# EasyEDA Pro project lora_repeter_2.eprj

# Schematic lora_repeter_2
Board Name: lora_repeter_2; Create Date: 2025-03-23; Page Name: lora_repeter_2; Project Name: lora_repeter_2; Schematic Name: lora_repeter_2; Update Date: 2025-03-23; File: lora_repeter_2; Id: /; Sheet: /
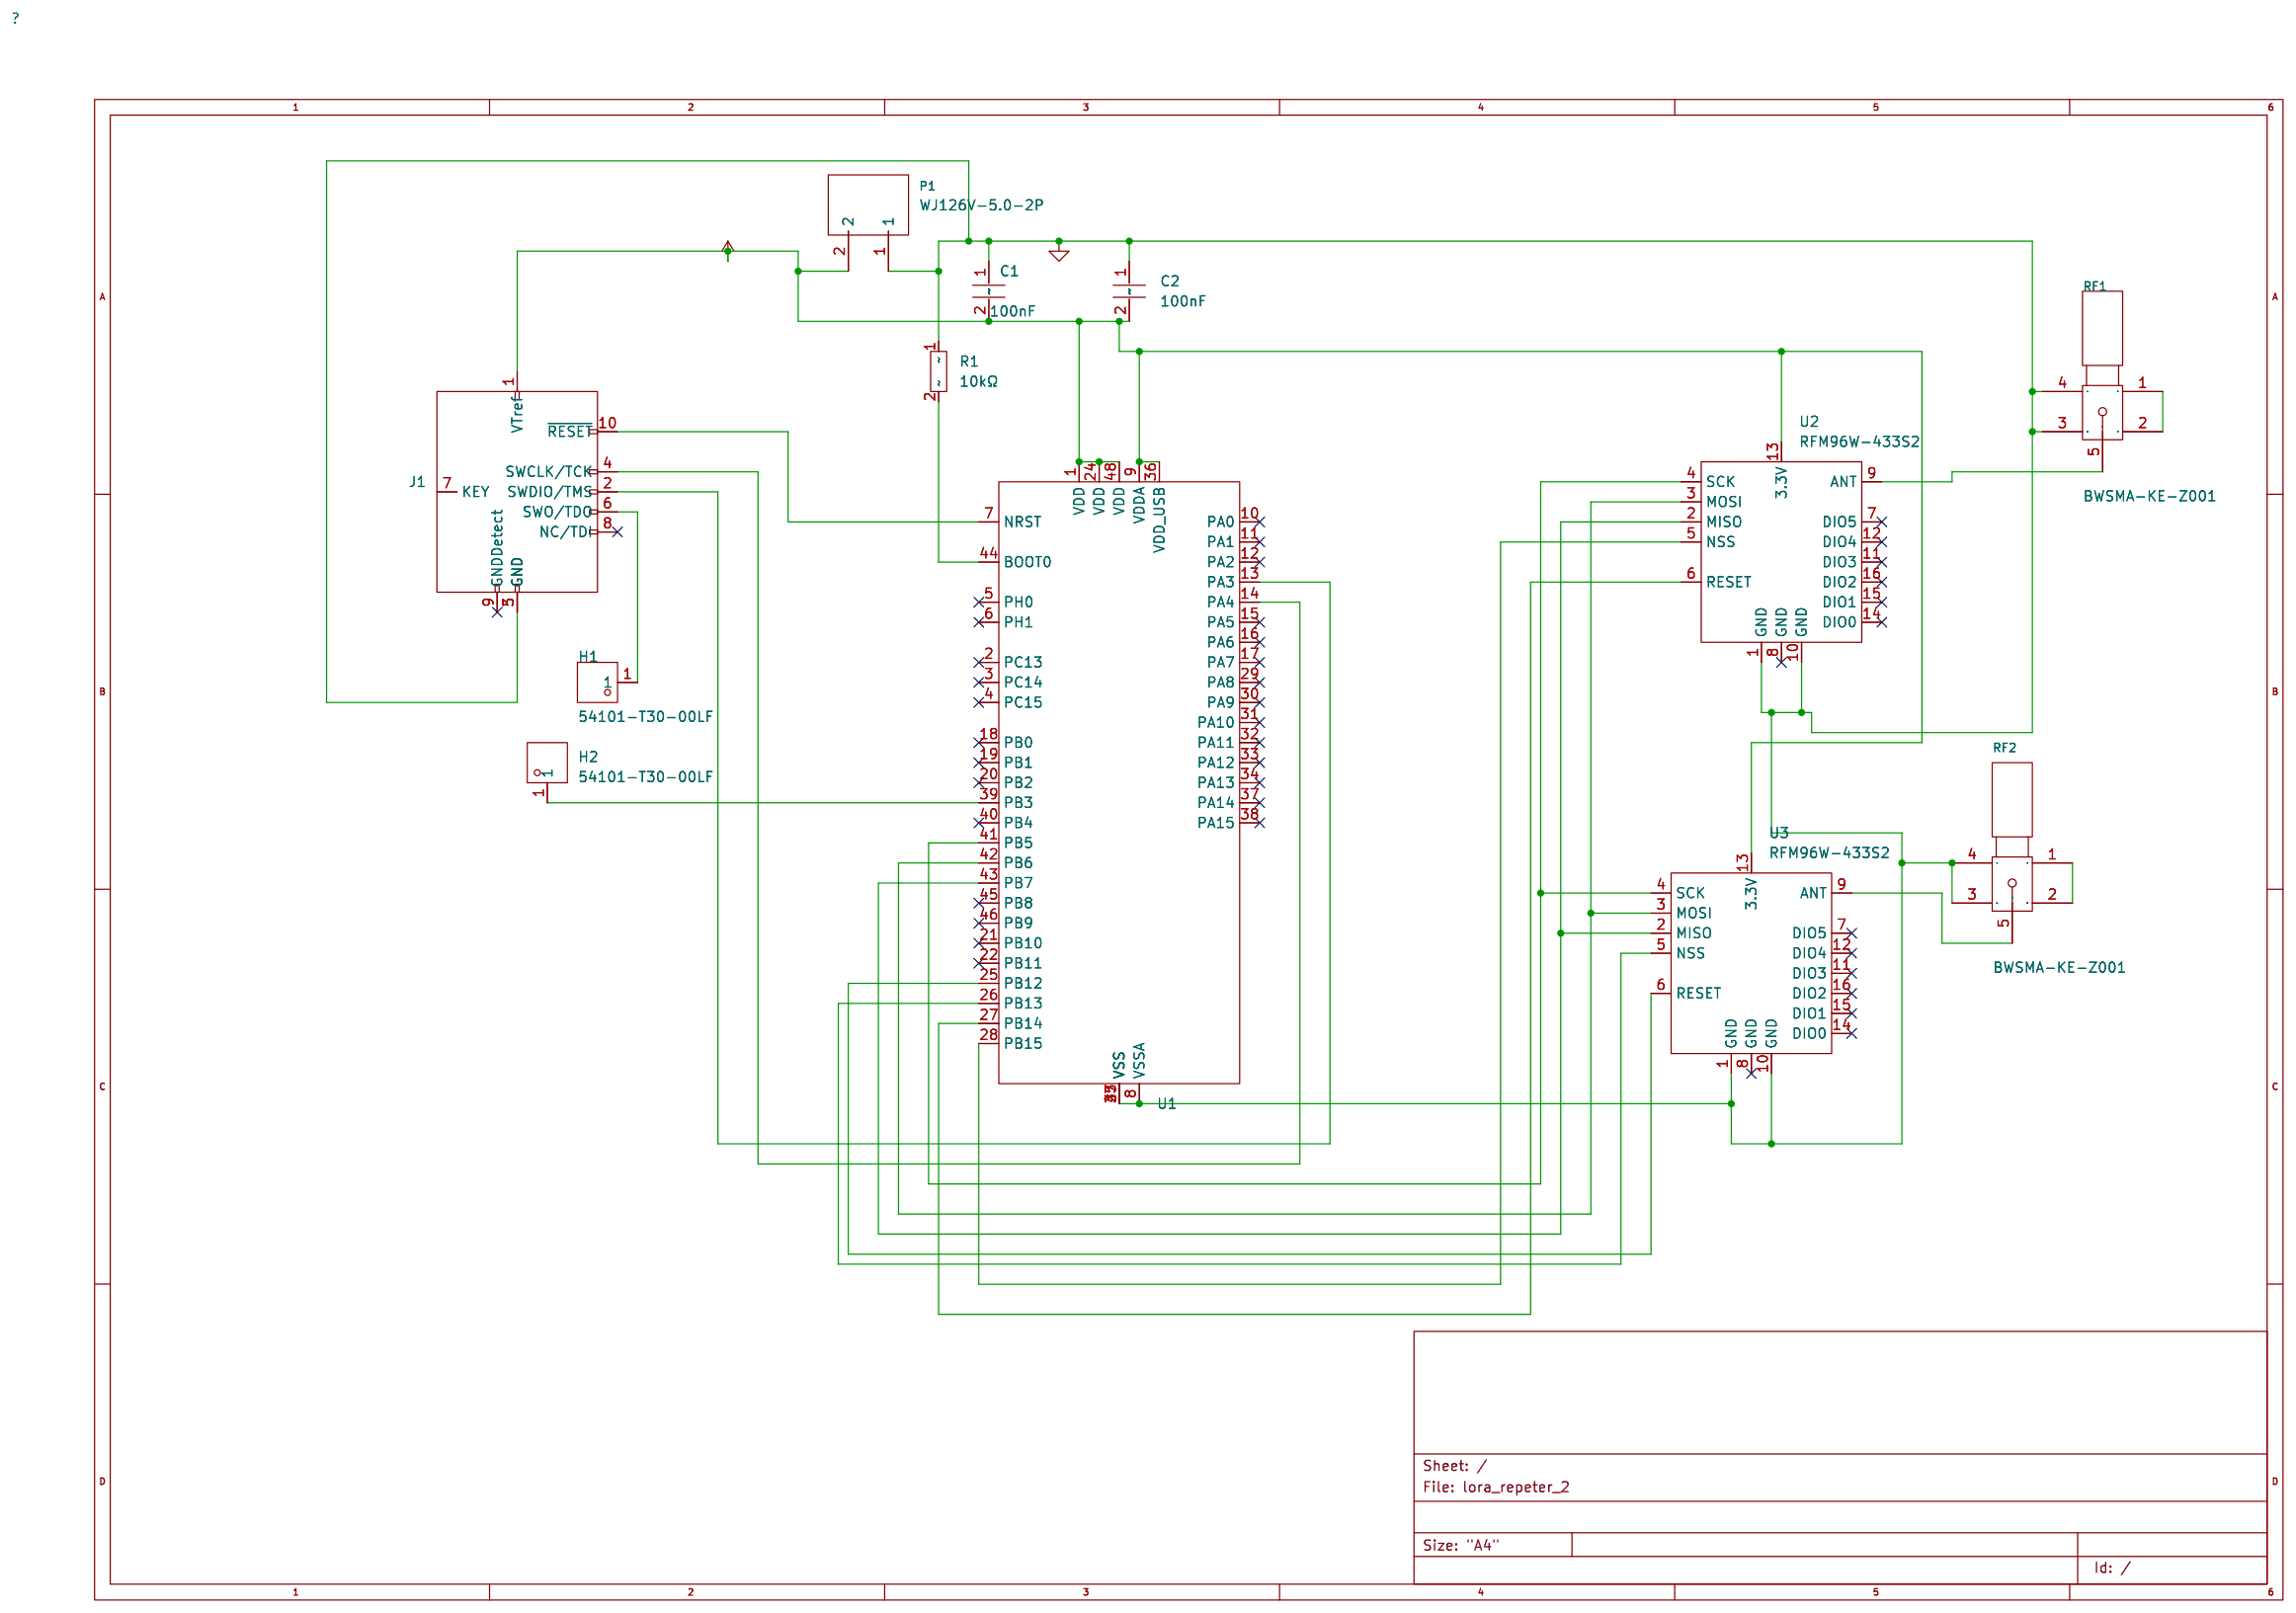
[diagram p0: schematic sheet]

## Parts
C1  100nF  [CAP-TH_L5.0-W2.5-P5.08-D0.7]
C2  100nF  [CAP-TH_L5.0-W2.5-P5.08-D0.7]
H1  54101-T30-00LF  [HDR-TH_1P-P2.54-V-M]
H2  54101-T30-00LF  [HDR-TH_1P-P2.54-V-M]
J1  2.54-2*5P简牛  [IDC-TH_10P-P2.54_C5665]
P1  WJ126V-5.0-2P  [CONN-TH_WJ126V-5.0-2P]
R1  10kΩ  [RES-TH_BD2.3-L6.5-P10.50-D0.5]
RF1  BWSMA-KE-Z001  [SMA-TH_BWSMA-KE-Z001]
RF2  BWSMA-KE-Z001  [SMA-TH_BWSMA-KE-Z001]
U1  STM32L072CBT6  [LQFP-48_L7.0-W7.0-P0.50-LS9.0-BL]
U2  RFM96W-433S2
U3  RFM96W-433S2

## Library data of the parts
C1 C2 = CC1H104ZC74D3F5O30MN: Capacitance: Tolerance:-20%~+80% Tolerance:-20%~+80% Voltage Rated: Lead Spacing: Temperature Coefficient: φD: Body Thickness:; LCSC Part Name: 100nF -20%~+80% 50V; Supplier Part: C254094; Manufacturer: Dersonic(德尔创); Supplier Footprint: 插件,P=5.08mm; JLCPCB Part Class: Extended Part; Datasheet: https://atta.szlcsc.com/upload/public/pdf/source/20200826/C254094_5CB2628DB82B55380EF0EA1FCCF0C073.pdf; Supplier: LCSC; Tolerance: -20%~+80%
H1 H2 = 54101-T30-00LF: LCSC Part Name: 54101-T30-00LF 单排针，价格为单根针，包装为圆盘; Supplier Part: C5156075; Manufacturer: Amphenol; Supplier Footprint: 插件,P=2.54mm; JLCPCB Part Class: Extended Part; Datasheet: https://atta.szlcsc.com/upload/public/pdf/source/20221214/EBCE81CA20C160EAA37EFECDD5FC8CA8.pdf; Supplier: LCSC
J1 = 2.54-2*5P简牛: Connector Type:简牛座 Pitch:2.54mm Structure:2x5P Holder Type:Straight Row Spacing:2.54mm Number of Rows:2 Pin Number in each Row:5 Contact Material:- Contact Plating:-; LCSC Part Name: 2.54mm 2x5P 排数:2 每排P数:5; Supplier Part: C5665; Manufacturer: BOOMELE(博穆精密); Supplier Footprint: 插件,P=2.54mm; JLCPCB Part Class: Extended Part; Datasheet: https://atta.szlcsc.com/upload/public/pdf/source/20140331/1457707037896.pdf; Supplier: LCSC; Connector Type: 简牛座; Pitch: 2.54mm; Structure: 2x5P; Holder Type: Straight; Row Spacing: 2.54mm; Number of Rows: 2; Pin Number in each Row: 5
P1 = WJ126V-5.0-2P: LCSC Part Name: 5mm 1x2P 排数:1 每排P数:2 直插; Supplier Part: C8404; Manufacturer: KANGNEX(康奈克斯电气); Supplier Footprint: 插件,P=5mm; JLCPCB Part Class: Extended Part; Datasheet: https://atta.szlcsc.com/upload/public/pdf/source/20191225/C8404_8F52D87DF851D149A4DEA9BD9FA83F9A.pdf; Supplier: LCSC; Structure: 1x2P; Pitch: 5mm; Color: Green; Mounting Style: Straight; Current Rating (Max): 18A; Voltage Rating (Max): 250V; Number of Pins: 2P; Number of Rows: 1; Wire Gauge - AWG: 14~26; Wire Gauge - mm2: 2.5; Number of PINs Per Row: 2; Operating Temperature Range: -40℃~+105℃
R1 = MF1/4W-10KΩ±1% T: Type:Metal Film Resistors Resistance: Tolerance:±1% Tolerance:±1% Voltage-Supply(Max):250V Power(Watts):250mW Temperature Coefficient:±100ppm/℃ Temperature Coefficient:±100ppm/℃ Operating Temperature:-55℃~+155℃ Operating Temperature:-55℃~+155℃; LCSC Part Name: 10kΩ ±1% 250mW 金属膜电阻 圆柱状直插; Supplier Part: C119347; Manufacturer: CCO(千志电子); Supplier Footprint: 插件,D2.3xL6.5mm; JLCPCB Part Class: Extended Part; Datasheet: https://atta.szlcsc.com/upload/public/pdf/source/20190910/C427326_62A6D058BC0FF74963A2F22379CA06CE.pdf; Supplier: LCSC; Type: Metal Film Resistors; Tolerance: ±1%; Voltage-Supply(Max): 250V; Power(Watts): 250mW; Temperature Coefficient: ±100ppm/℃; Operating Temperature: -55℃~+155℃
RF1 RF2 = BWSMA-KE-Z001_C496549: LCSC Part Name: 内孔 SMA 正脚; Supplier Part: C496549; Manufacturer: BAT WIRELESS(蝙蝠无线); Supplier Footprint: 插件; JLCPCB Part Class: Extended Part; Datasheet: https://atta.szlcsc.com/upload/public/pdf/source/20221228/40BF41E56A06003A0210E1785CA66EA6.pdf; Supplier: LCSC; Connector Type: 板端; Interface Type: 内孔; Number of Ports: 1; RF Series: SMA; Impedance: 50Ω; Style: 正脚; Operating Temperature Range: -65℃~+165℃
U1 = STM32L072CBT6: CPU Core:ARM-M0 CPU Maximum Speed:32MHz Program Storage Size:128KB Program Memory Type:FLASH Number of I/O:37 ADC (Bit):12bit DAC (Bit):12bit Low Voltage Detection Threshold:1.65V~3.6V Low Voltage Detection Threshold:1.65V~3.6V Application Area:-; LCSC Part Name: 超低功耗Arm Cortex-M0+ MCU，具有128-KB Flash存储器、32 MHz CPU和USB; Supplier Part: C465977; Manufacturer: ST(意法半导体); Supplier Footprint: LQFP-48(7x7); JLCPCB Part Class: Extended Part; Datasheet: https://atta.szlcsc.com/upload/public/pdf/source/20191209/C465977_16F709537D8B3F0614D9090C9C399883.pdf; Supplier: LCSC; CPU Core: ARM-M0; CPU Maximum Speed: 32MHz; Program Storage Size: 128KB; Program Memory Type: FLASH; Number of I/O: 37; ADC (Bit): 12bit; DAC (Bit): 12bit; Low Voltage Detection Threshold: 1.65V~3.6V
U2 U3 = RF_Module_RFM96W-433S2: Low power long range transceiver module, SPI and parallel interface, 433 MHz, spreading factor 6 to12, bandwidth 7.8 to 500kHz, -111 to -148 dBm, SMD-16, DIP-16; User doc link: https://www.hoperf.com/data/upload/portal/20181127/5bfcc0ac60235.pdf

## Nets
POWER_+3.3V: C1.2 C2.2 J1.1(VTref) P1.2 U1.1(VDD) U1.9(VDDA) U1.24(VDD) U1.36(VDD_USB) U1.48(VDD) U2.13(3.3V) U3.13(3.3V)
POWER_GND: C1.1 C2.1 J1.3(GND) J1.5(GND) P1.1 R1.1 RF1.3 RF1.4 RF2.3 RF2.4 U1.8(VSSA) U1.23(VSS) U1.35(VSS) U1.47(VSS) U2.1(GND) U2.10(GND) U3.1(GND) U3.10(GND)
Net-(H1-1): H1.1 J1.6(SWO/TDO)
Net-(H2-1): H2.1 U1.39(PB3)
Net-(J1-2): J1.2(SWDIO/TMS) U1.13(PA3)
Net-(J1-4): J1.4(SWCLK/TCK) U1.14(PA4)
Net-(J1-10): J1.10(~{RESET}) U1.7(NRST)
Net-(R1-2): R1.2 U1.44(BOOT0)
Net-(RF1-1): RF1.1 RF1.2
Net-(RF1-5): RF1.5 U2.9(ANT)
Net-(RF2-1): RF2.1 RF2.2
Net-(RF2-5): RF2.5 U3.9(ANT)
Net-(U1-25): U1.25(PB12) U3.6(RESET)
Net-(U1-26): U1.26(PB13) U3.5(NSS)
Net-(U1-27): U1.27(PB14) U2.6(RESET)
Net-(U1-28): U1.28(PB15) U2.5(NSS)
Net-(U1-41): U1.41(PB5) U2.4(SCK) U3.4(SCK)
Net-(U1-42): U1.42(PB6) U2.3(MOSI) U3.3(MOSI)
Net-(U1-43): U1.43(PB7) U2.2(MISO) U3.2(MISO)

Not connected (* = marked no-connect by the designer): J1 7(KEY) 8(NC/TDI)* 9(GNDDetect)*; U1 2(PC13)* 3(PC14)* 4(PC15)* 5(PH0)* 6(PH1)* 10(PA0)* 11(PA1)* 12(PA2)* 15(PA5)* 16(PA6)* 17(PA7)* 18(PB0)* 19(PB1)* 20(PB2)* 21(PB10)* 22(PB11)* 29(PA8)* 30(PA9)* 31(PA10)* 32(PA11)* 33(PA12)* 34(PA13)* 37(PA14)* 38(PA15)* 40(PB4)* 45(PB8)* 46(PB9)*; U2 7(DIO5)* 8(GND)* 11(DIO3)* 12(DIO4)* 14(DIO0)* 15(DIO1)* 16(DIO2)*; U3 7(DIO5)* 8(GND)* 11(DIO3)* 12(DIO4)* 14(DIO0)* 15(DIO1)* 16(DIO2)*
